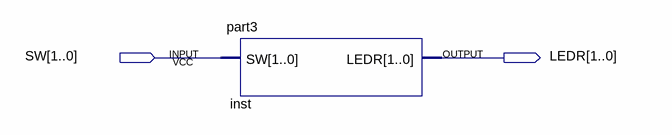
[diagram p0: schematic sheet]
// Quartus schematic Lab3.bdf as structural Verilog: 1 symbols, 2 pins
module Lab3 (
  input  [1:0] SW,
  output [1:0] LEDR
);

  part3 inst (.SW(SW), .LEDR(LEDR));
endmodule
